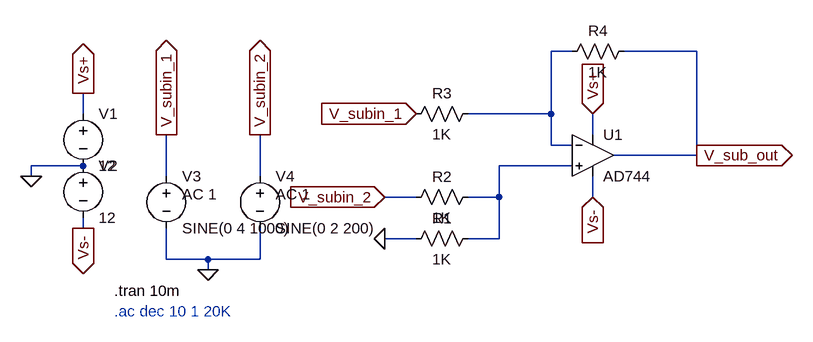
[diagram p0: schematic Subtractor.asc]
Subtractor.asc, the LTspice schematic file:
Version 4.1
SHEET 1 880 680
WIRE 240 -320 208 -320
WIRE 432 -320 320 -320
WIRE -512 -224 -512 -256
WIRE 208 -224 208 -320
WIRE 208 -224 80 -224
WIRE 272 -192 272 -224
WIRE 208 -176 208 -224
WIRE 240 -176 208 -176
WIRE 432 -160 432 -320
WIRE 432 -160 304 -160
WIRE -512 -144 -592 -144
WIRE 240 -144 128 -144
WIRE -592 -128 -592 -144
WIRE -384 -128 -384 -192
WIRE -240 -128 -240 -192
WIRE 0 -96 -48 -96
WIRE 128 -96 128 -144
WIRE 128 -96 80 -96
WIRE 272 -96 272 -128
WIRE -512 -48 -512 -64
WIRE 0 -32 -48 -32
WIRE 128 -32 128 -96
WIRE 128 -32 80 -32
WIRE -384 0 -384 -48
WIRE -320 0 -384 0
WIRE -240 0 -240 -48
WIRE -240 0 -320 0
WIRE -320 16 -320 0
FLAG 0 -224 V_subin_1
IOPIN 0 -224 In
FLAG -48 -96 V_subin_2
IOPIN -48 -96 In
FLAG -48 -32 0
FLAG 432 -160 V_sub_out
IOPIN 432 -160 Out
FLAG 272 -224 Vs+
IOPIN 272 -224 In
FLAG 272 -96 Vs-
IOPIN 272 -96 In
FLAG -592 -128 0
FLAG -512 -256 Vs+
IOPIN -512 -256 Out
FLAG -512 -48 Vs-
IOPIN -512 -48 Out
FLAG -320 16 0
FLAG -240 -192 V_subin_2
IOPIN -240 -192 Out
FLAG -384 -192 V_subin_1
IOPIN -384 -192 Out
SYMBOL OpAmps\\AD744 272 -224 R0
SYMATTR InstName U1
SYMBOL res 96 -48 R90
WINDOW 0 0 56 VBottom 2
WINDOW 3 32 56 VTop 2
SYMATTR InstName R1
SYMATTR Value 1K
SYMATTR SpiceLine tol=1 pwr=0.1
SYMBOL res 96 -112 R90
WINDOW 0 0 56 VBottom 2
WINDOW 3 32 56 VTop 2
SYMATTR InstName R2
SYMATTR Value 1K
SYMATTR SpiceLine tol=1 pwr=0.1
SYMBOL res 96 -240 R90
WINDOW 0 0 56 VBottom 2
WINDOW 3 32 56 VTop 2
SYMATTR InstName R3
SYMATTR Value 1K
SYMATTR SpiceLine tol=1 pwr=0.1
SYMBOL res 336 -336 R90
WINDOW 0 0 56 VBottom 2
WINDOW 3 32 56 VTop 2
SYMATTR InstName R4
SYMATTR Value 1K
SYMATTR SpiceLine tol=1 pwr=0.1
SYMBOL voltage -512 -240 R0
WINDOW 123 0 0 Left 0
WINDOW 39 0 0 Left 0
SYMATTR InstName V1
SYMATTR Value 12
SYMBOL voltage -512 -160 R0
WINDOW 123 0 0 Left 0
WINDOW 39 0 0 Left 0
SYMATTR InstName V2
SYMATTR Value 12
SYMBOL voltage -384 -144 R0
WINDOW 123 24 44 Left 2
WINDOW 39 0 0 Left 0
SYMATTR Value2 AC 1
SYMATTR InstName V3
SYMATTR Value SINE(0 4 1000)
SYMBOL voltage -240 -144 R0
WINDOW 123 24 44 Left 2
WINDOW 39 0 0 Left 0
SYMATTR Value2 AC 1
SYMATTR InstName V4
SYMATTR Value SINE(0 2 200)
TEXT -464 48 Left 2 !.tran 10m
TEXT -464 80 Left 2 ;.ac dec 10 1 20K

The netlist it stands for:
* Subtractor.asc
X§U1 N002 N001 Vs+ Vs- V_sub_out AD744  ; pins In+ In- V+ V- OUT
R1 N002 0 1K tol=1 pwr=0.1
R2 N002 V_subin_2 1K tol=1 pwr=0.1
R3 N001 V_subin_1 1K tol=1 pwr=0.1
R4 V_sub_out N001 1K tol=1 pwr=0.1
V1 Vs+ 0 12
V2 0 Vs- 12
V3 V_subin_1 0 SINE(0 4 1000) AC 1
V4 V_subin_2 0 SINE(0 2 200) AC 1
.tran 10m
* .ac dec 10 1 20K
.backanno
.end